# EAGLE design protoshield_mayfly_v1_a (EAGLE 7.4.0)
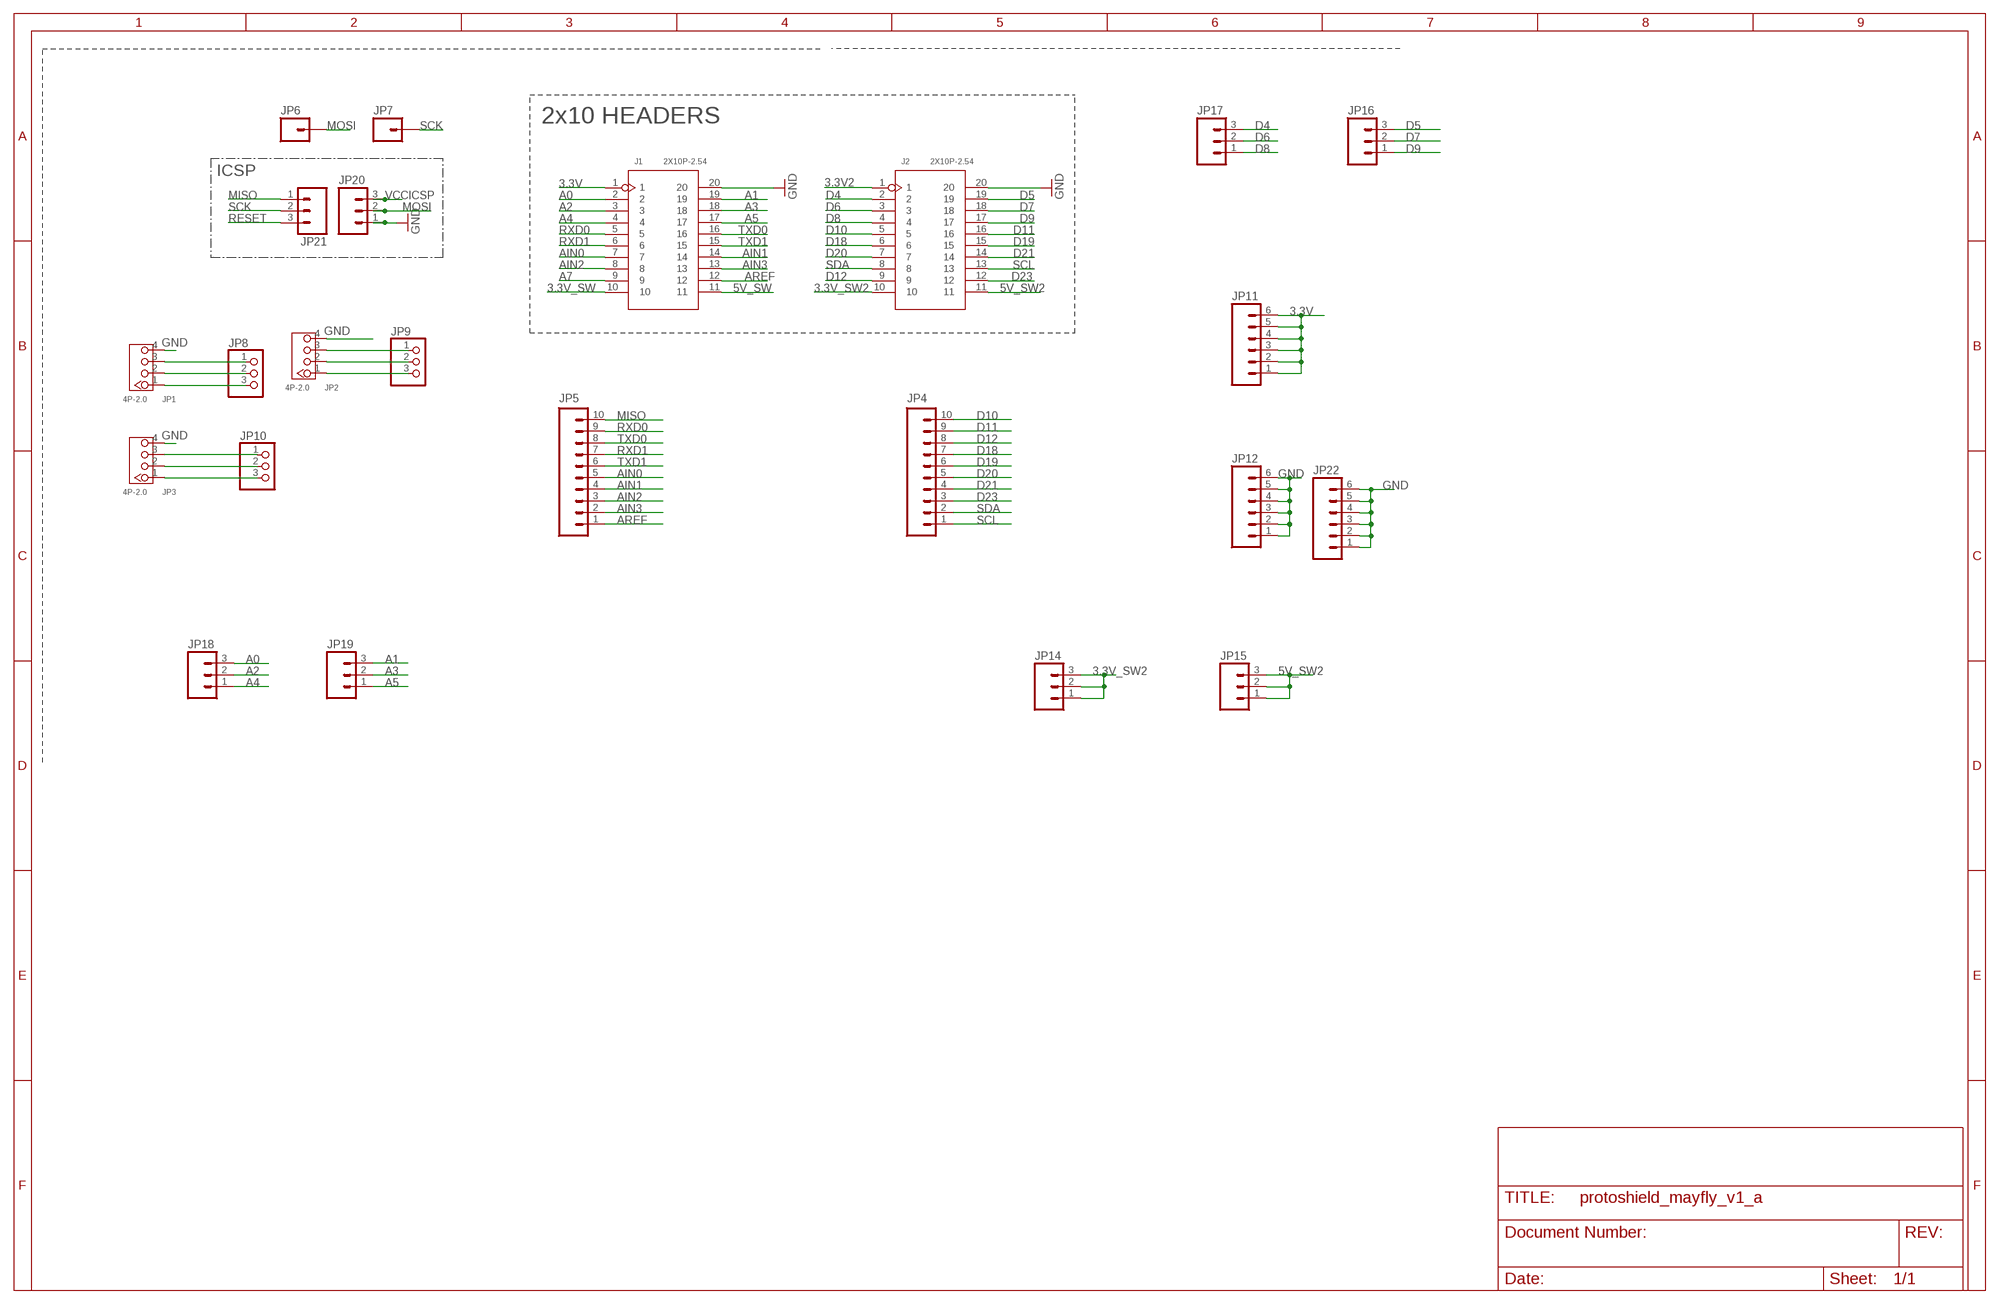
[diagram p0: schematic, sheet 1]

## Parts
J1  2X10P-2.54  DIP-BLACK-FEMALE-HEADER(2X10P-2.54)-2.54  [H2X10-2.54]
J2  2X10P-2.54  DIP-BLACK-FEMALE-HEADER(2X10P-2.54)-2.54  [H2X10-2.54]
JP1  4P-2.0  GROVE-CONNECTOR-DIP(4P-2.0)  [HW4-2.0]
JP2  4P-2.0  GROVE-CONNECTOR-DIP(4P-2.0)  [HW4-2.0]
JP3  4P-2.0  GROVE-CONNECTOR-DIP(4P-2.0)  [HW4-2.0]
JP4  M10NO_SILK_PTH_FEMALE  [1X10_NO_SILK]
JP5  M10NO_SILK_PTH_FEMALE  [1X10_NO_SILK]
JP6  M01PTH_NO_SILK_YES_STOP  [1X01_NO_SILK]
JP7  M01PTH_NO_SILK_YES_STOP  [1X01_NO_SILK]
JP8  PINHD-1X3CB  [1X03-CLEANBIG]
JP9  PINHD-1X3CB  [1X03-CLEANBIG]
JP10  PINHD-1X3CB  [1X03-CLEANBIG]
JP11  M06NO_SILK_FEMALE_PTH  [1X06_NO_SILK]
JP12  M06NO_SILK_YES_STOP  [1X06_NO_SILK_YES_STOP]
JP14  M031X03_NO_SILK  [1X03_NO_SILK]
JP15  M031X03_NO_SILK  [1X03_NO_SILK]
JP16  M031X03_NO_SILK  [1X03_NO_SILK]
JP17  M031X03_NO_SILK  [1X03_NO_SILK]
JP18  M031X03_NO_SILK  [1X03_NO_SILK]
JP19  M031X03_NO_SILK  [1X03_NO_SILK]
JP20  M031X03_NO_SILK  [1X03_NO_SILK]
JP21  M031X03_NO_SILK  [1X03_NO_SILK]
JP22  M06NO_SILK_YES_STOP  [1X06_NO_SILK_YES_STOP]

## Nets
3.3V: J1.1 JP11.1 JP11.2 JP11.3 JP11.4 JP11.5 JP11.6
3.3V2: J2.1
3.3V_SW: J1.10
3.3V_SW2: J2.10 JP14.1 JP14.2 JP14.3
5V_SW: J1.11
5V_SW2: J2.11 JP15.1 JP15.2 JP15.3
A0: J1.2 JP18.3
A1: J1.19 JP19.3
A2: J1.3 JP18.2
A3: J1.18 JP19.2
A4: J1.4 JP18.1
A5: J1.17 JP19.1
A7: J1.9
AIN0: J1.7 JP5.5
AIN1: J1.14 JP5.4
AIN2: J1.8 JP5.3
AIN3: J1.13 JP5.2
AREF: J1.12 JP5.1
D4: J2.2 JP17.3
D5: J2.19 JP16.3
D6: J2.3 JP17.2
D7: J2.18 JP16.2
D8: J2.4 JP17.1
D9: J2.17 JP16.1
D10: J2.5 JP4.10
D11: J2.16 JP4.9
D12: J2.9 JP4.8
D18: J2.6 JP4.7
D19: J2.15 JP4.6
D20: J2.7 JP4.5
D21: J2.14 JP4.4
D23: J2.12 JP4.3
GND: J1.20 J2.20 JP1.4 JP2.4 JP3.4 JP12.1 JP12.2 JP12.3 JP12.4 JP12.5 JP12.6 JP20.1 JP22.1 JP22.2 JP22.3 JP22.4 JP22.5 JP22.6
MISO: JP5.10 JP21.1
MOSI: JP6.1 JP20.2
N$1: JP1.1 JP8.3
N$2: JP1.2 JP8.2
N$3: JP1.3 JP8.1
N$4: JP3.1 JP10.3
N$5: JP3.2 JP10.2
N$6: JP3.3 JP10.1
N$10: JP2.3 JP9.1
N$11: JP2.1 JP9.3
N$13: JP2.2 JP9.2
RESET: JP21.3
RXD0: J1.5 JP5.9
RXD1: J1.6 JP5.7
SCK: JP7.1 JP21.2
SCL: J2.13 JP4.1
SDA: J2.8 JP4.2
TXD0: J1.16 JP5.8
TXD1: J1.15 JP5.6
VCCICSP: JP20.3

## Notes on the sheet
- 2x10 HEADERS
- ICSP

## Library data of the parts
J1 J2 = Seeed-OPL-Connector:DIP-BLACK-FEMALE-HEADER(2X10P-2.54): 320030090; MPN: F185-1210A0BA1
JP1-JP3 = Seeed-OPL-Connector:GROVE-CONNECTOR-DIP(4P-2.0): 320110033
JP4 JP5 = SparkFun-Connectors:M10: Header 10 Standard 10-pin 0.1" header. Use with straight break away headers (SKU : PRT-00116), right angle break away headers (PRT-00553), swiss pins (PRT-00743), machine pins (PRT-00117), and female headers (PRT-00115).; PROD_ID: CONN-11563
JP6 JP7 = SparkFun-Connectors:M01: Header 1 Standard 1-pin 0.1" header. Use with straight break away headers (SKU : PRT-00116), right angle break away headers (PRT-00553), swiss pins (PRT-00743), machine pins (PRT-00117), and female headers (PRT-00115).
JP8-JP10 = adafruit:PINHD-1X3: PIN HEADER
JP11 = SparkFun-Connectors:M06: Header 6 Standard 6-pin 0.1" header. Use with straight break away headers (SKU : PRT-00116), right angle break away headers (PRT-00553), swiss pins (PRT-00743), machine pins (PRT-00117), and female headers (PRT-00115). Molex polarized connector foot print use with SKU : PRT-08094 with associated crimp pins and housings. NOTES ON THE VARIANTS LOCK and LOCK_LONGPADS... This footprint was designed to help hold the alignment of a through-hole component (i.e. 6-pin header) while soldering it into place. You may notice that each hole has been shifted either up or down by 0.005 of an inch from it's more standard position (which is a perfectly straight line). This slight alteration caused the pins (the squares in the middle) to touch the edges of the holes. Because they are alternating, it causes a "brace" to hold the component in place. 0.005 has proven to be the perfect amount of "off-center" position when using our standard breakaway headers. Although looks a little odd when you look at the bare footprint, once you have a header in there, the alteration is very hard to notice. Also,if you push a header all the way into place, it is covered up entirely on the bottom side. This idea of altering the position of holes to aid alignment will be further integrated into the Sparkfun Library for other footprints. It can help hold any component with 3 or more connection pins.; PROD_ID: CONN-08437
JP12 JP22 = SparkFun-Connectors:M06: Header 6 Standard 6-pin 0.1" header. Use with straight break away headers (SKU : PRT-00116), right angle break away headers (PRT-00553), swiss pins (PRT-00743), machine pins (PRT-00117), and female headers (PRT-00115). Molex polarized connector foot print use with SKU : PRT-08094 with associated crimp pins and housings. NOTES ON THE VARIANTS LOCK and LOCK_LONGPADS... This footprint was designed to help hold the alignment of a through-hole component (i.e. 6-pin header) while soldering it into place. You may notice that each hole has been shifted either up or down by 0.005 of an inch from it's more standard position (which is a perfectly straight line). This slight alteration caused the pins (the squares in the middle) to touch the edges of the holes. Because they are alternating, it causes a "brace" to hold the component in place. 0.005 has proven to be the perfect amount of "off-center" position when using our standard breakaway headers. Although looks a little odd when you look at the bare footprint, once you have a header in there, the alteration is very hard to notice. Also,if you push a header all the way into place, it is covered up entirely on the bottom side. This idea of altering the position of holes to aid alignment will be further integrated into the Sparkfun Library for other footprints. It can help hold any component with 3 or more connection pins.
JP14-JP21 = SparkFun-Connectors:M03: Header 3 Standard 3-pin 0.1" header. Use with straight break away headers (SKU : PRT-00116), right angle break away headers (PRT-00553), swiss pins (PRT-00743), machine pins (PRT-00117), and female headers (PRT-00115). Molex polarized connector foot print use with SKU : PRT-08232 with associated crimp pins and housings.

## Board
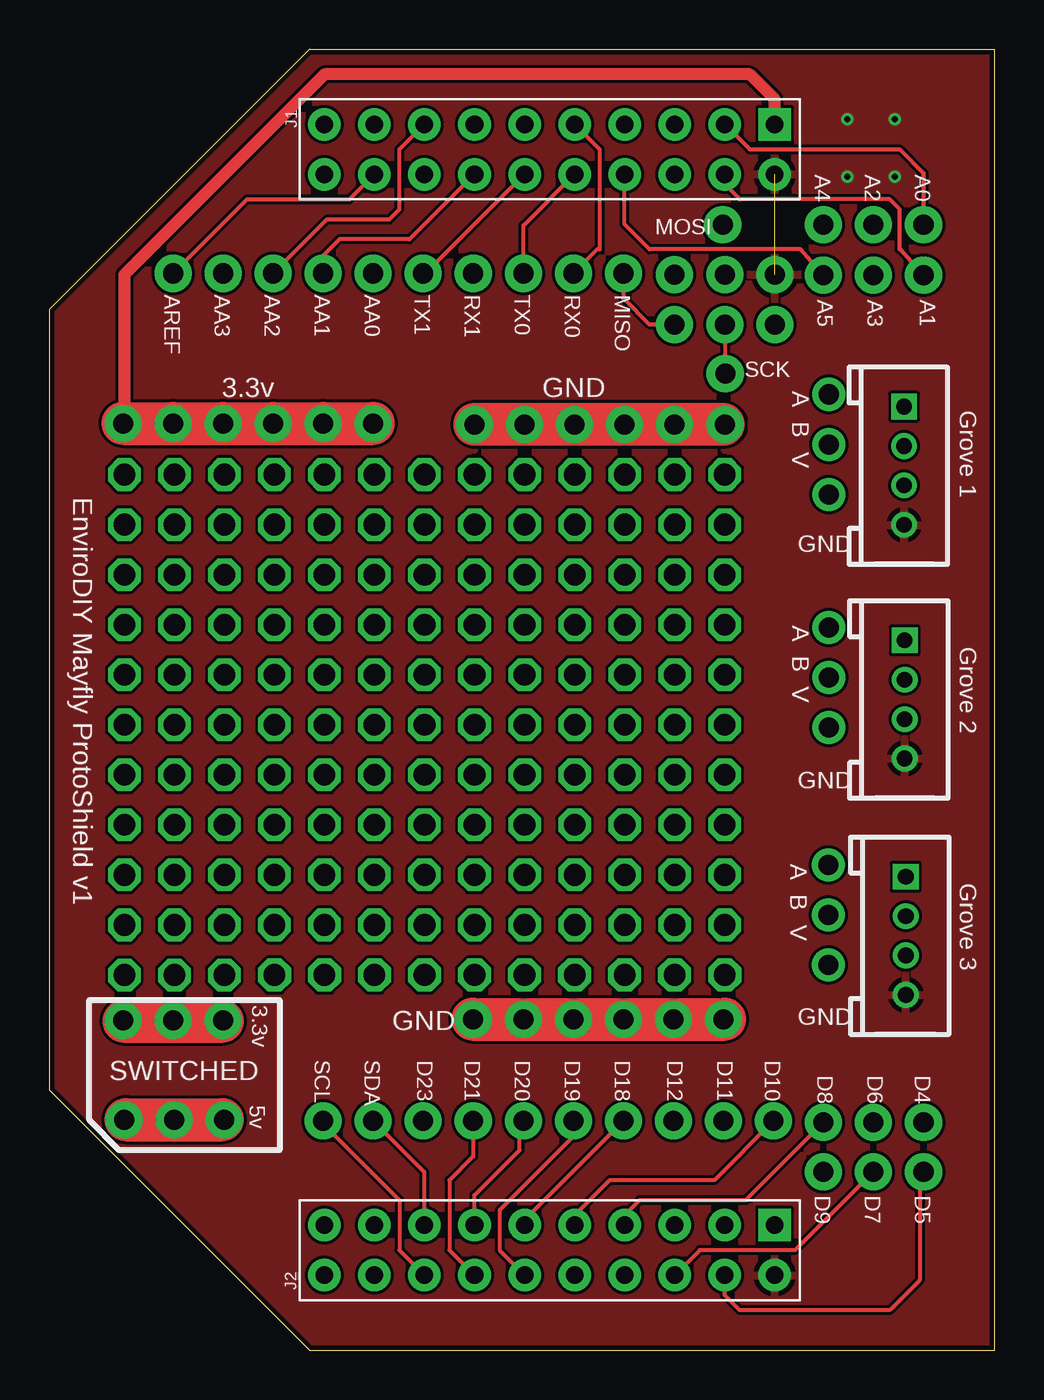
[diagram p1: board, top side]
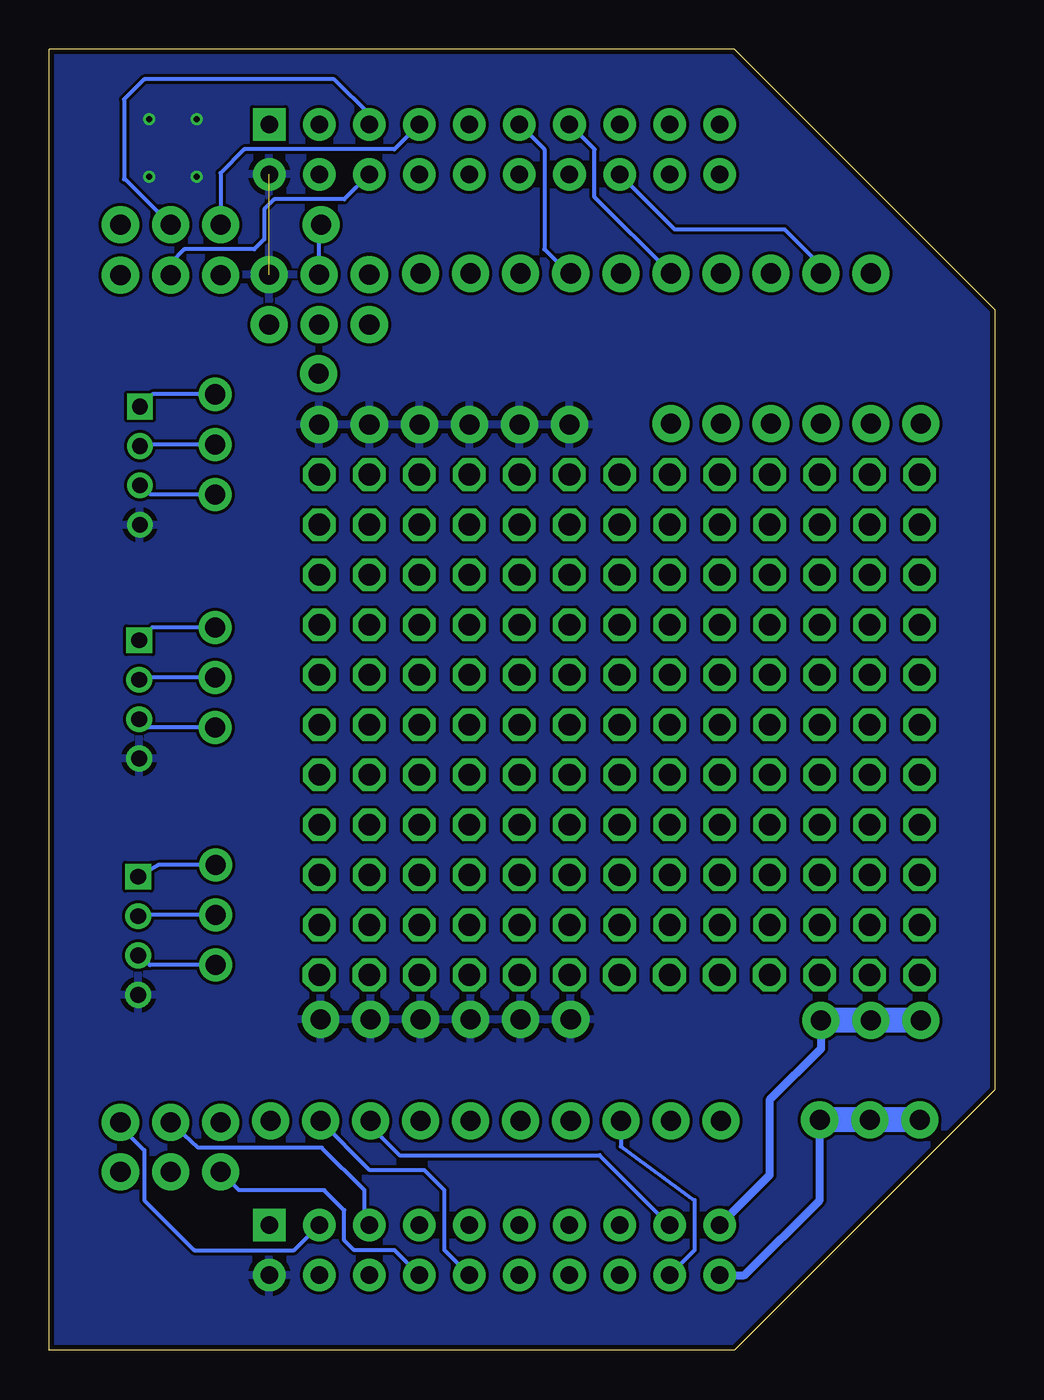
[diagram p2: board, bottom side, seen from below]

Size 48 x 66.04 mm. Coordinates in mm from the lower left corner, seen from the top.
Outline: 0,52.83 0,13.21 13.21,0 48,0 48,66.04 13.21,66.04 0,52.83
Copper layers (1*16): Top 0.035mm / dielectric 1.5mm / Bottom 0.035mm
Design rules "SeeedStudio_2layer_DRU_no_angle_20140221": minimum track width 6mil, minimum drill 12mil, track to track 6mil, track to pad 6mil, pad to pad 6mil, via to via 6mil, smd to smd 0mil, copper to edge 10mil, drill to drill 10mil, minimum pad ring 10mil, minimum via ring 6mil, stop-mask expansion 2mil, vias tented up to drill 100mil, thermal gap 10mil

### Footprints (pad centres in the part's own frame; a part is rotated, then mirrored left to right if it is on the bottom)
H2X10-2.54 = drill 0.889 pad 1.651 square: 1 -1.27,11.43 | drill 0.889 pad 1.651: 2 -1.27,8.89; 3 -1.27,6.35; 4 -1.27,3.81; 5 -1.27,1.27; 6 -1.27,-1.27; 7 -1.27,-3.81; 8 -1.27,-6.35; 9 -1.27,-8.89; 10 -1.27,-11.43; 11 1.27,-11.43; 12 1.27,-8.89; 13 1.27,-6.35; 14 1.27,-3.81; 15 1.27,-1.27; 16 1.27,1.27; 17 1.27,3.81; 18 1.27,6.35; 19 1.27,8.89; 20 1.27,11.43
HW4-2.0 = drill 0.8 pad 1.27 square: 1 -3,0 | drill 0.8 pad 1.27: 2 -1,0; 3 1,0; 4 3,0
1X10_NO_SILK = drill 1.016 pad 1.88: 1 0,0; 2 2.54,0; 3 5.08,0; 4 7.62,0; 5 10.16,0; 6 12.7,0; 7 15.24,0; 8 17.78,0; 9 20.32,0; 10 22.86,0
1X01_NO_SILK = drill 1.016 pad 1.88: 1 0,0
1X03-CLEANBIG = drill 1.016 pad 1.676: 1 -2.54,0; 2 0,0; 3 2.54,0
1X06_NO_SILK = drill 1.016 pad 1.88: 1 0,0; 2 2.54,0; 3 5.08,0; 4 7.62,0; 5 10.16,0; 6 12.7,0
1X06_NO_SILK_YES_STOP = drill 1.016 pad 1.88: 1 0,0; 2 2.54,0; 3 5.08,0; 4 7.62,0; 5 10.16,0; 6 12.7,0
1X03_NO_SILK = drill 1.016 pad 1.88: 1 0,0; 2 2.54,0; 3 5.08,0

### Placement (x,y rotation side)
J1  25.4,60.96 270 top
J2  25.4,5.08 270 top
JP1  43.43,33.03 270 top
JP2  43.4,44.9 270 top
JP3  43.48,21.04 270 top
JP4  13.91,11.64 0 top
JP5  6.29,54.66 0 top
JP6  34.19,57.13 0 top
JP7  34.31,49.57 0 top
JP8  39.59,34.15 90 top
JP9  39.58,45.98 90 top
JP10  39.55,22.09 90 top
JP11  3.75,47.05 0 top
JP12  21.53,16.79 0 top
JP14  3.75,16.74 0 top
JP15  3.81,11.68 0 top
JP16  39.31,9.06 0 top
JP17  39.31,11.57 0 top
JP18  39.31,57.14 0 top
JP19  39.31,54.57 0 top
JP20  36.83,54.61 180 top
JP21  31.75,52.07 0 top
JP22  21.59,46.99 0 top

### Tracks (layer width: path | path; a pad name or v marks a point on that pad's centre or on a via)
3.3V
  Top 0.61: J1.1 36.83,63.5 35.56,64.77 13.97,64.77 3.81,54.61 3.81,47.11 JP11.1
  Top 2.184: JP11.1 JP11.2 JP11.3 JP11.4 JP11.5 JP11.6
  Bottom 1.27: JP11.5 13.97,46.99 13.96,46.99 JP11.5
3.3V_SW2
  Bottom 0.406: JP14.3 8.83,15.3 11.43,12.7 11.43,8.89 J2.10
  Bottom 1.27: JP14.1 JP14.2 JP14.3
5V_SW2
  Bottom 0.406: J2.11 12.7,3.81 8.89,7.62 JP15.3
  Bottom 1.27: JP15.1 JP15.2 JP15.3
A0
  Top 0.203: J1.2 35.56,60.96 43.18,60.96 44.39,59.75 JP18.3
A1
  Top 0.203: JP19.3 43.2,55.88 43.18,55.88 43.18,57.91 42.67,58.42 35.05,58.42 34.29,59.18 J1.19
A2
  Bottom 0.203: J1.3 31.75,62.74 33.53,64.52 43.18,64.52 44.2,63.5 44.2,59.44 44.14,59.44 JP18.2
A3
  Bottom 0.203: J1.18 33.02,58.42 36.58,58.42 37.08,57.91 37.08,56.39 37.59,55.88 41.15,55.88 41.85,55.18 JP19.2
A4
  Bottom 0.203: J1.4 30.48,60.96 38.1,60.96 39.31,59.75 JP18.1
A5
  Top 0.203: JP19.1 38.12,55.88 30.48,55.88 29.21,57.15 J1.17
AIN0
  Bottom 0.203: JP5.5 20.32,58.54 20.32,60.96 J1.7
AIN1
  Top 0.203: J1.14 18.29,56.39 14.73,56.39 13.91,55.56 JP5.4
AIN2
  Top 0.203: JP5.3 14.11,57.4 17.27,57.4 17.78,57.91 17.78,60.96 J1.8
AIN3
  Bottom 0.203: J1.13 16.26,56.9 10.67,56.9 8.83,55.05 JP5.2
AREF
  Top 0.203: JP5.1 10.04,58.42 15.24,58.42 J1.12
D4
  Bottom 0.203: JP17.3 44.39,11.37 43.18,10.16 43.18,7.62 40.64,5.08 35.56,5.08 J2.2
D5
  Top 0.203: JP16.3 44.2,8.87 44.2,3.56 42.67,2.03 35.05,2.03 34.29,2.79 J2.19
D6
  Bottom 0.203: J2.3 32,6.35 32,8.13 34.16,10.29 40.43,10.29 JP17.2
D7
  Top 0.203: JP16.2 37.86,5.08 33.02,5.08 J2.18
D8
  Top 0.203: JP17.1 35.35,7.62 29.97,7.62 29.21,6.86 J2.4
D9
  Bottom 0.203: J2.17 30.48,5.08 32.51,5.08 33.02,5.59 33.02,7.11 34.04,8.13 38.37,8.13 JP16.1
D10
  Top 0.203: JP4.10 33.77,8.64 28.45,8.64 26.67,6.86 J2.5
D11
  Bottom 0.203: J2.16 27.94,5.08 27.94,8.13 28.96,9.14 31.73,9.14 JP4.9
D12
  Bottom 0.203: JP4.8 31.69,11.37 30.23,9.91 20.07,9.91 J2.9
D18
  Top 0.203: JP4.7 24.13,6.62 J2.6
D19
  Top 0.203: JP4.6 26.61,10.86 22.86,7.11 22.86,5.08 J2.15
D20
  Top 0.203: J2.7 21.59,7.87 23.88,10.16 23.88,11.45 JP4.5
D21
  Top 0.203: JP4.4 21.53,9.84 20.32,8.64 20.32,5.08 J2.14
D23
  Bottom 0.203: JP4.3 18.99,10.35 15.24,7.62 15.24,5.08 J2.12
GND  (via drill 0.3)  (1 unrouted)
  other vias: 40.51,62.48 40.51,59.56 42.93,59.56 42.93,62.48
  pour Bottom: -0.7,67.54 49.8,67.04 50.1,-0.7 -0.6,-0.6
  pour Top: -1.3,68.04 50.5,67.74 50.6,-1.2 -1.1,-1.2
MISO
  Top 0.203: JP5.10 29.15,53.4 30.48,52.07 JP21.1
MOSI
  Bottom 0.203: JP20.2 34.29,57.03 JP6.1
N$1
  Bottom 0.203: JP8.3 42.77,36.69 JP1.1
N$2
  Bottom 0.203: JP8.2 43.31,34.15 JP1.2
N$3
  Bottom 0.203: JP8.1 43.01,31.61 JP1.3
N$4
  Bottom 0.203: JP10.3 42.48,24.63 JP3.1
N$5
  Bottom 0.203: JP10.2 43.44,22.09 JP3.2
N$6
  Bottom 0.203: JP10.1 42.9,19.55 JP3.3
N$7  (via drill 1.1)
  other vias: 34.29,44.45
N$8
  Top 2.184: 21.6,47 34.2,47
N$9
  Top 2.184: 21.5,16.8 34.3,16.8
N$10
  Bottom 0.203: JP9.1 42.85,43.44 JP2.3
N$11
  Bottom 0.203: JP9.3 42.76,48.52 JP2.1
N$13
  Bottom 0.203: JP9.2 43.3,45.98 JP2.2
N$14
  Top 2.184: 3.8,16.7 8.8,16.7
N$15
  Top 2.184: 3.9,11.7 8.8,11.7
N$25  (via drill 1.1 pad 1.68)
  other vias: 34.29,19.05
N$26  (via drill 1.1 pad 1.68)
  other vias: 31.75,19.05
N$27  (via drill 1.1 pad 1.68)
  other vias: 29.21,19.05
N$28  (via drill 1.1 pad 1.68)
  other vias: 26.67,19.05
N$29  (via drill 1.1 pad 1.68)
  other vias: 24.13,19.05
N$30  (via drill 1.1)
  other vias: 34.29,41.91
N$31  (via drill 1.1 pad 1.68)
  other vias: 21.59,19.05
N$32  (via drill 1.1 pad 1.68)
  other vias: 19.05,19.05
N$33  (via drill 1.1 pad 1.68)
  other vias: 16.51,19.05
N$34  (via drill 1.1 pad 1.68)
  other vias: 13.97,19.05
N$35  (via drill 1.1 pad 1.68)
  other vias: 11.43,19.05
N$36  (via drill 1.1)
  other vias: 8.89,19.05
N$37  (via drill 1.1)
  other vias: 6.35,19.05
N$38  (via drill 1.1)
  other vias: 3.81,19.05
N$39  (via drill 1.1)
  other vias: 34.29,39.37
N$40  (via drill 1.1)
  other vias: 34.29,36.83
N$41  (via drill 1.1)
  other vias: 34.29,34.29
N$42  (via drill 1.1)
  other vias: 34.29,31.75
N$43  (via drill 1.1)
  other vias: 34.29,29.21
N$44  (via drill 1.1)
  other vias: 34.29,26.67
N$45  (via drill 1.1)
  other vias: 34.29,24.13
N$46  (via drill 1.1)
  other vias: 34.29,21.59
N$47  (via drill 1.1)
  other vias: 3.81,21.59
N$48  (via drill 1.1)
  other vias: 6.35,21.59
N$49  (via drill 1.1)
  other vias: 8.89,21.59
N$50  (via drill 1.1)
  other vias: 11.43,21.59
N$51  (via drill 1.1)
  other vias: 13.97,21.59
N$52  (via drill 1.1)
  other vias: 16.51,21.59
N$53  (via drill 1.1)
  other vias: 19.05,21.59
N$54  (via drill 1.1)
  other vias: 21.59,21.59
N$55  (via drill 1.1)
  other vias: 24.13,21.59
N$56  (via drill 1.1)
  other vias: 26.67,21.59
N$57  (via drill 1.1)
  other vias: 29.21,21.59
N$58  (via drill 1.1)
  other vias: 31.75,21.59
N$59  (via drill 1.1)
  other vias: 31.75,24.13
N$60  (via drill 1.1)
  other vias: 31.75,26.67
N$61  (via drill 1.1)
  other vias: 31.75,29.21
N$62  (via drill 1.1)
  other vias: 31.75,44.45
N$63  (via drill 1.1)
  other vias: 29.21,44.45
N$64  (via drill 1.1)
  other vias: 26.67,44.45
N$65  (via drill 1.1)
  other vias: 24.13,44.45
N$66  (via drill 1.1)
  other vias: 24.13,41.91
N$67  (via drill 1.1)
  other vias: 26.67,41.91
N$68  (via drill 1.1)
  other vias: 29.21,41.91
N$69  (via drill 1.1)
  other vias: 31.75,41.91
N$70  (via drill 1.1)
  other vias: 31.75,39.37
N$71  (via drill 1.1)
  other vias: 29.21,39.37
N$72  (via drill 1.1)
  other vias: 26.67,39.37
N$73  (via drill 1.1)
  other vias: 24.13,39.37
N$74  (via drill 1.1)
  other vias: 24.13,36.83
N$75  (via drill 1.1)
  other vias: 26.67,36.83
N$76  (via drill 1.1)
  other vias: 29.21,36.83
N$77  (via drill 1.1)
  other vias: 31.75,36.83
N$78  (via drill 1.1)
  other vias: 31.75,34.29
N$79  (via drill 1.1)
  other vias: 31.75,31.75
N$80  (via drill 1.1)
  other vias: 29.21,31.75
N$81  (via drill 1.1)
  other vias: 29.21,34.29
N$82  (via drill 1.1)
  other vias: 26.67,34.29
N$83  (via drill 1.1)
  other vias: 24.13,34.29
N$84  (via drill 1.1)
  other vias: 24.13,29.21
N$85  (via drill 1.1)
  other vias: 24.13,31.75
N$86  (via drill 1.1)
  other vias: 26.67,31.75
N$87  (via drill 1.1)
  other vias: 26.67,29.21
N$88  (via drill 1.1)
  other vias: 29.21,29.21
N$89  (via drill 1.1)
  other vias: 24.13,26.67
N$90  (via drill 1.1)
  other vias: 26.67,26.67
N$91  (via drill 1.1)
  other vias: 29.21,26.67
N$92  (via drill 1.1)
  other vias: 29.21,24.13
N$93  (via drill 1.1)
  other vias: 26.67,24.13
N$94  (via drill 1.1)
  other vias: 24.13,24.13
N$95  (via drill 1.1)
  other vias: 3.81,44.45
N$96  (via drill 1.1)
  other vias: 6.35,44.45
N$97  (via drill 1.1)
  other vias: 8.89,44.45
N$98  (via drill 1.1)
  other vias: 11.43,44.45
N$99  (via drill 1.1)
  other vias: 13.97,44.45
N$100  (via drill 1.1)
  other vias: 16.51,44.45
N$101  (via drill 1.1)
  other vias: 19.05,44.45
N$102  (via drill 1.1)
  other vias: 21.59,44.45
N$103  (via drill 1.1)
  other vias: 21.59,41.91
N$104  (via drill 1.1)
  other vias: 19.05,41.91
N$105  (via drill 1.1)
  other vias: 16.51,41.91
N$106  (via drill 1.1)
  other vias: 13.97,41.91
N$107  (via drill 1.1)
  other vias: 11.43,41.91
N$108  (via drill 1.1)
  other vias: 8.89,41.91
N$109  (via drill 1.1)
  other vias: 6.35,41.91
N$110  (via drill 1.1)
  other vias: 3.81,41.91
N$111  (via drill 1.1)
  other vias: 3.81,39.37
N$112  (via drill 1.1)
  other vias: 6.35,39.37
N$113  (via drill 1.1)
  other vias: 8.89,39.37
N$114  (via drill 1.1)
  other vias: 11.43,39.37
N$115  (via drill 1.1)
  other vias: 13.97,39.37
N$116  (via drill 1.1)
  other vias: 16.51,39.37
N$117  (via drill 1.1)
  other vias: 19.05,39.37
N$118  (via drill 1.1)
  other vias: 21.59,39.37
N$119  (via drill 1.1)
  other vias: 21.59,36.83
N$120  (via drill 1.1)
  other vias: 19.05,36.83
N$121  (via drill 1.1)
  other vias: 16.51,36.83
N$122  (via drill 1.1)
  other vias: 13.97,36.83
N$123  (via drill 1.1)
  other vias: 11.43,36.83
N$124  (via drill 1.1)
  other vias: 8.89,36.83
N$125  (via drill 1.1)
  other vias: 6.35,36.83
N$126  (via drill 1.1)
  other vias: 3.81,36.83
N$127  (via drill 1.1)
  other vias: 3.81,34.29
N$128  (via drill 1.1)
  other vias: 6.35,34.29
N$129  (via drill 1.1)
  other vias: 8.89,34.29
N$130  (via drill 1.1)
  other vias: 11.43,34.29
N$131  (via drill 1.1)
  other vias: 13.97,34.29
N$132  (via drill 1.1)
  other vias: 16.51,34.29
N$133  (via drill 1.1)
  other vias: 19.05,34.29
N$134  (via drill 1.1)
  other vias: 21.59,34.29
N$135  (via drill 1.1)
  other vias: 21.59,31.75
N$136  (via drill 1.1)
  other vias: 19.05,31.75
N$137  (via drill 1.1)
  other vias: 16.51,31.75
N$138  (via drill 1.1)
  other vias: 13.97,31.75
N$139  (via drill 1.1)
  other vias: 11.43,31.75
N$140  (via drill 1.1)
  other vias: 8.89,31.75
N$141  (via drill 1.1)
  other vias: 6.35,31.75
N$142  (via drill 1.1)
  other vias: 3.81,31.75
N$143  (via drill 1.1)
  other vias: 3.81,29.21
N$144  (via drill 1.1)
  other vias: 6.35,29.21
N$145  (via drill 1.1)
  other vias: 8.89,29.21
N$146  (via drill 1.1)
  other vias: 11.43,29.21
N$147  (via drill 1.1)
  other vias: 13.97,29.21
N$148  (via drill 1.1)
  other vias: 16.51,29.21
N$149  (via drill 1.1)
  other vias: 19.05,29.21
N$150  (via drill 1.1)
  other vias: 21.59,29.21
N$151  (via drill 1.1)
  other vias: 21.59,26.67
N$152  (via drill 1.1)
  other vias: 19.05,26.67
N$153  (via drill 1.1)
  other vias: 16.51,26.67
N$154  (via drill 1.1)
  other vias: 13.97,26.67
N$155  (via drill 1.1)
  other vias: 11.43,26.67
N$156  (via drill 1.1)
  other vias: 8.89,26.67
N$157  (via drill 1.1)
  other vias: 6.35,26.67
N$158  (via drill 1.1)
  other vias: 3.81,26.67
N$159  (via drill 1.1)
  other vias: 3.81,24.13
N$160  (via drill 1.1)
  other vias: 6.35,24.13
N$161  (via drill 1.1)
  other vias: 8.89,24.13
N$162  (via drill 1.1)
  other vias: 11.43,24.13
N$163  (via drill 1.1)
  other vias: 13.97,24.13
N$164  (via drill 1.1)
  other vias: 16.51,24.13
N$165  (via drill 1.1)
  other vias: 19.05,24.13
N$166  (via drill 1.1)
  other vias: 21.59,24.13
RXD0
  Top 0.203: J1.5 27.94,60.96 27.94,55.88 27.82,55.88 JP5.9
RXD1
  Bottom 0.203: J1.6 22.86,60.96 22.86,55.88 21.64,54.66 JP5.7
SCK
  Top 0.203: JP21.2 34.29,49.6 JP7.1
SCL
  Top 0.203: J2.13 17.78,5.08 17.78,7.62 13.91,11.49 JP4.1
SDA
  Top 0.203: J2.8 19.05,9.03 JP4.2
TXD0
  Top 0.203: JP5.8 24.07,57.09 J1.16
TXD1
  Top 0.203: J1.15 19.1,54.66 JP5.6

### Text on the board
tPlace: A B V | Grove 1 | GND | A B V | Grove 2 | EnviroDIY Mayfly ProtoShield v1 | GND | A B V | Grove 3 | GND | SWITCHED
tNames: A4 | A2 | A0 | MOSI | AREF | AA3 | AA2 | AA1 | AA0 | TX1 | RX1 | TX0 | RX0 | MISO | A5 | A3 | A1 | SCK | 3.3v | GND | 3.3v | GND | SCL | SDA | D23 | D21 | D20 | D19 | D18 | D12 | D11 | D10 | D8 | D6 | D4 | 5v | D9 | D7 | D5